# Altium schematic sheet ToC.SchDoc: Table of Contents
size 279 x 215 mm; DrawnBy: Connor Dack; Engineer: Connor Dack; DocumentNumber: 2; Revision: 1P2; SheetNumber: 2; SheetTotal: 20
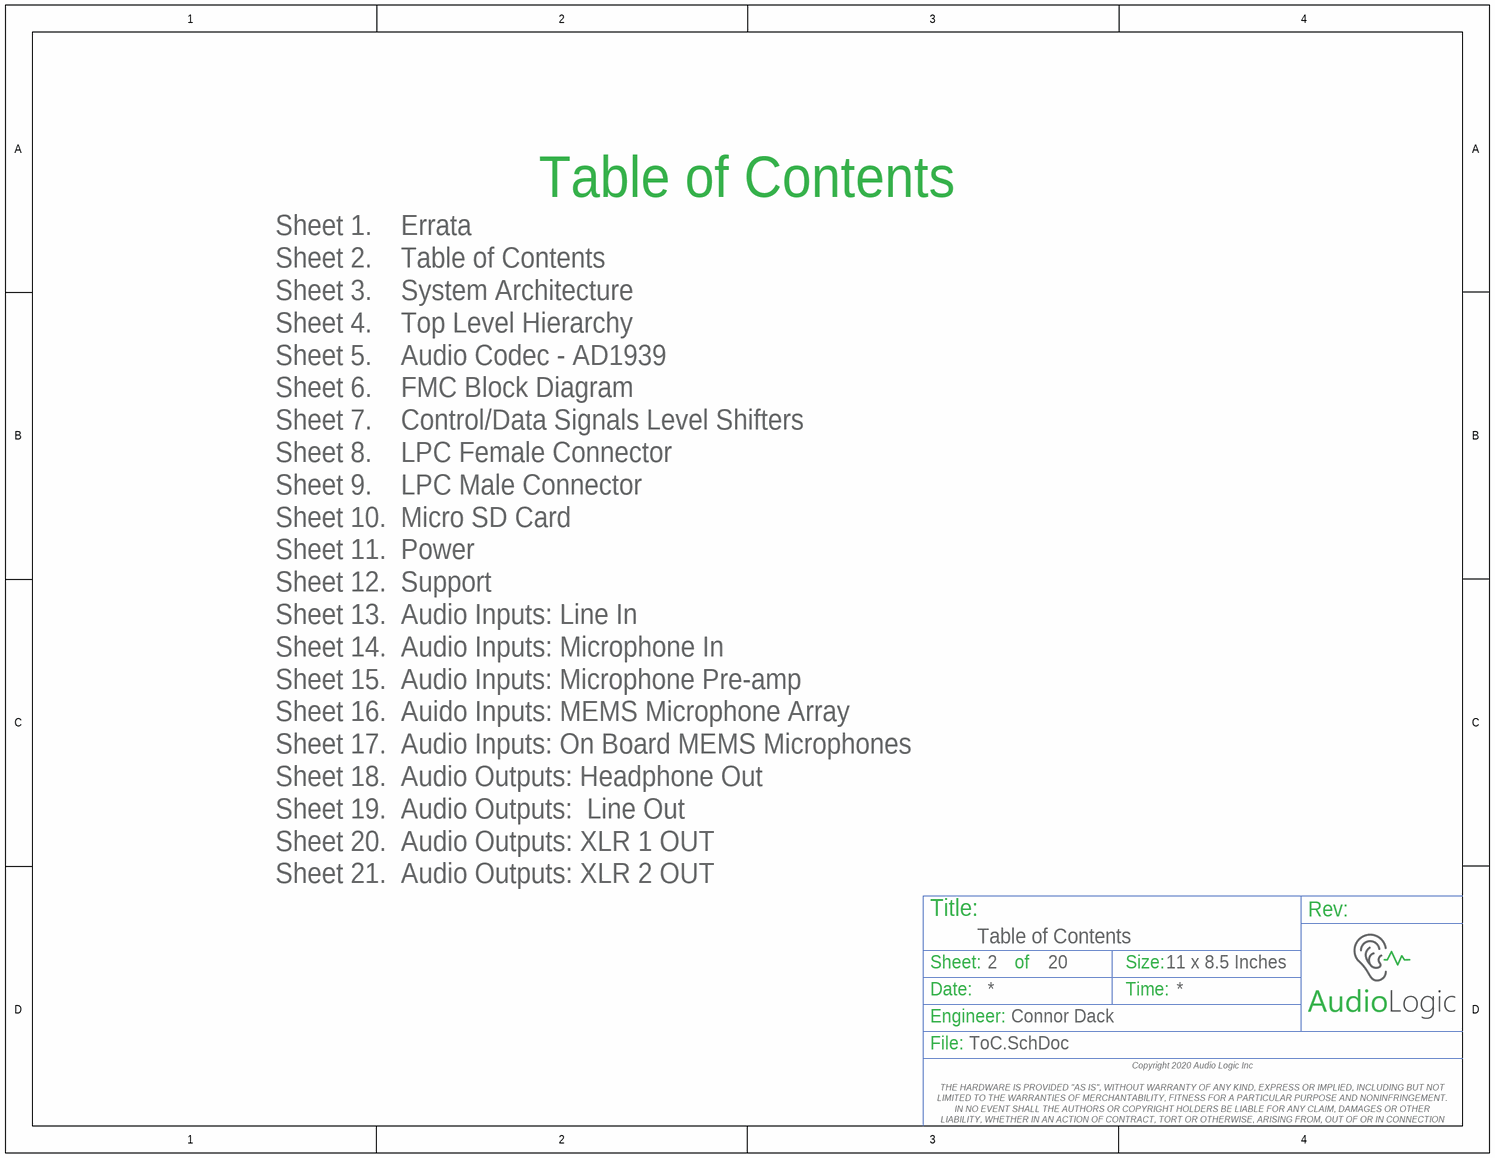
[diagram p0: ToC.SchDoc]

## Notes on the sheet
- Table of Contents
- Sheet 1.    Errata
  Sheet 2.    Table of Contents
  Sheet 3.    System Architecture
  Sheet 4.    Top Level Hierarchy
  Sheet 5.    Audio Codec - AD1939
  Sheet 6.    FMC Block Diagram
  Sheet 7.    Control/Data Signals Level Shifters
  Sheet 8.    LPC Female Connector
  Sheet 9.    LPC Male Connector
  Sheet 10.  Micro SD Card
  Sheet 11.  Power
  Sheet 12.  Support
  Sheet 13.  Audio Inputs: Line In
  Sheet 14.  Audio Inputs: Microphone In
  Sheet 15.  Audio Inputs: Microphone Pre-amp
  Sheet 16.  Auido Inputs: MEMS Microphone Array
  Sheet 17.  Audio Inputs: On Board MEMS Microphones
  Sheet 18.  Audio Outputs: Headphone Out
  Sheet 19.  Audio Outputs:  Line Out
  Sheet 20.  Audio Outputs: XLR 1 OUT
  Sheet 21.  Audio Outputs: XLR 2 OUT
- Title:
- Sheet:
- of
- Size:
- 11 x 8.5 Inches
- Rev:
- Date:
- Engineer:
- Time:
- File:
- Copyright 2020 Audio Logic Inc
  THE HARDWARE IS PROVIDED "AS IS", WITHOUT WARRANTY OF ANY KIND, EXPRESS OR IMPLIED, INCLUDING BUT NOT LIMITED TO THE WARRANTIES OF MERCHANTABILITY, FITNESS FOR A PARTICULAR PURPOSE AND NONINFRINGEMENT. IN NO EVENT SHALL THE AUTHORS OR COPYRIGHT HOLDERS BE LIABLE FOR ANY CLAIM, DAMAGES OR OTHER LIABILITY, WHETHER IN AN ACTION OF CONTRACT, TORT OR OTHERWISE, ARISING FROM, OUT OF OR IN CONNECTION WITH THE HARDWARE OR THE USE OR OTHER DEALINGS IN THE HARDWARE.